# Altium project PCB_Project1.PrjPCB
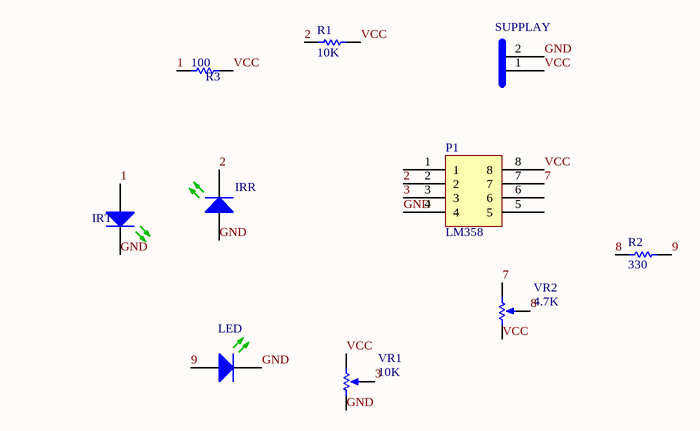
[diagram p0: Sheet4.SchDoc]
1 sheet, 10 parts. Net scope: global (net labels, ports and power ports of the same name join across sheets).
Board file: IR SENSOR.PcbDoc

## Sheet Sheet4.SchDoc
size A4

### Parts
IRR  (no value)  [LED-GREEN]
IRT  (no value)  [LED-GREEN]
LED  (no value)  [LED-GREEN]
P1  LM358  [dip-8pin]
R1  10K  [res- 2.54x3]
R2  330  [res- 2.54x3]
R3  100  [res- 2.54x3]
SUPPLAY  (no value)  [bergstrip-2pin]
VR1  10K  [reg-variable]
VR2  4.7K  [reg-variable]

### Nets
1: IRT.1(A) R3.1
2: IRR.2(K) P1.2 R1.1
3: P1.3 VR1.2(TAP)
7: P1.7 VR2.3(BOT)
8: R2.1 VR2.2(TAP)
9: LED.1(A) R2.2
GND: IRR.1(A) IRT.2(K) LED.2(K) P1.4 SUPPLAY.2 VR1.1(TOP)
VCC: P1.8 R1.2 R3.2 SUPPLAY.1 VR1.3(BOT) VR2.1(TOP)

Not connected (* = marked no-connect by the designer): P1 1 5 6

### Library data of the parts
IRR IRT LED = LED-GREEN: Typical RED GaAs LED; Published: 8-Jun-2000; LatestRevisionDate: 08-Jul-2005; LatestRevisionNote: Mech Layer 1 removed.; PackageReference: LED-1; Publisher: Altium Limited
P1 = ATML 911 240C04PU27
R1-R3 = Resistor 2.54x3
SUPPLAY = BURG STRIP 2
VR1 VR2 = Variable Resistor